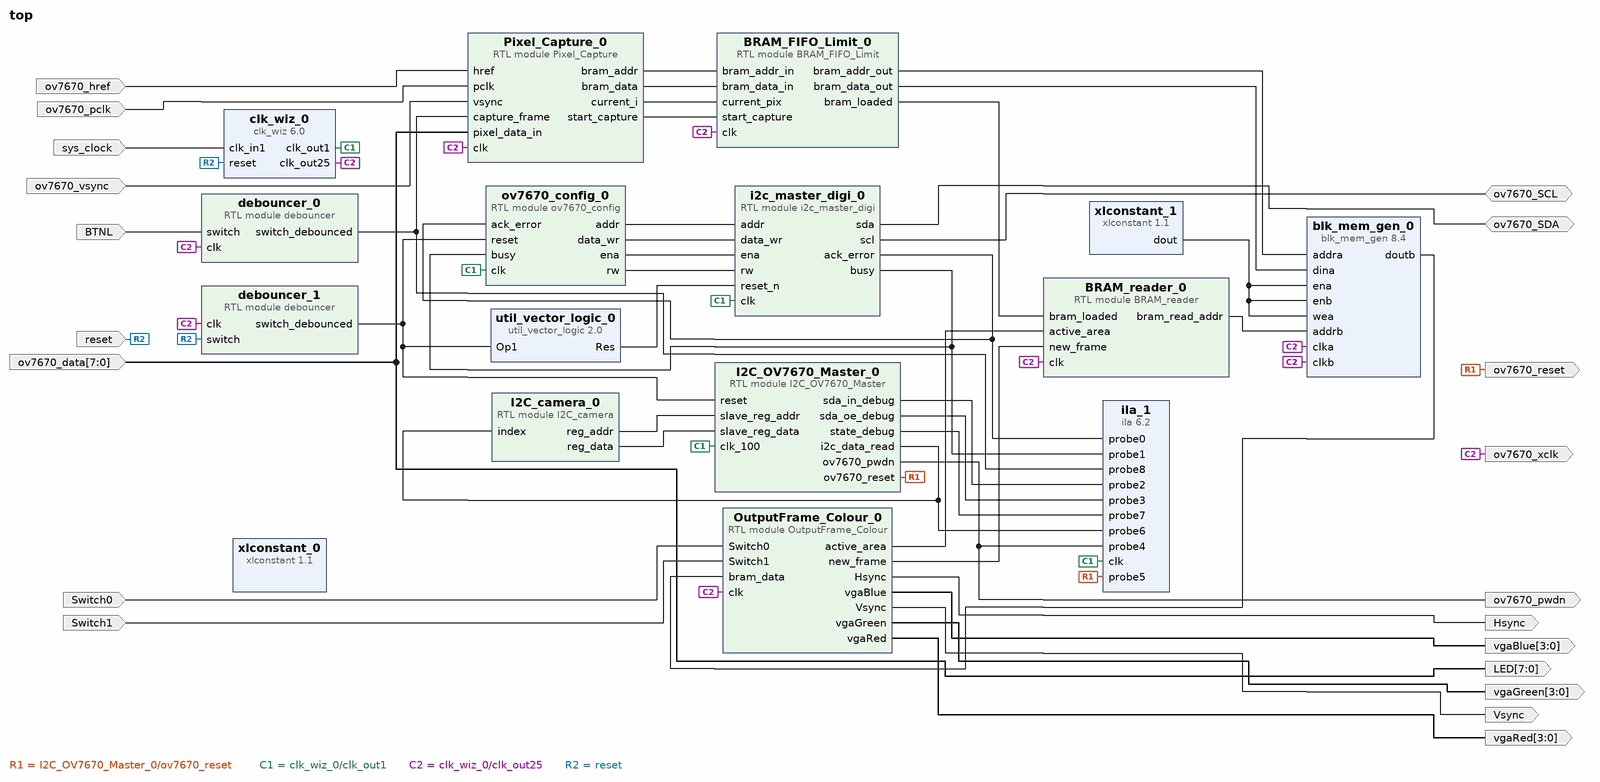
[diagram p0: block diagram of the top level]
# Vivado block design top, xc7a35tcpg236-1, Vivado 2023.2
create_bd_design top

create_bd_port -dir I -type clk sys_clock
set_property -dict {CONFIG.FREQ_HZ 100000000 CONFIG.PHASE 0.0} [get_bd_ports sys_clock]
create_bd_port -dir I -type rst reset
set_property -dict {CONFIG.POLARITY ACTIVE_HIGH} [get_bd_ports reset]
create_bd_port -dir I -from 7 -to 0 ov7670_data
create_bd_port -dir I ov7670_pclk
create_bd_port -dir I ov7670_href
create_bd_port -dir I ov7670_vsync
create_bd_port -dir I BTNL
create_bd_port -dir O Hsync
create_bd_port -dir O Vsync
create_bd_port -dir O -from 7 -to 0 LED
create_bd_port -dir O -from 3 -to 0 vgaRed
create_bd_port -dir O -from 3 -to 0 vgaGreen
create_bd_port -dir O -from 3 -to 0 vgaBlue
create_bd_port -dir I Switch0
create_bd_port -dir I Switch1
create_bd_port -dir O -type clk ov7670_xclk
create_bd_port -dir IO ov7670_SDA
create_bd_port -dir O ov7670_pwdn
create_bd_port -dir O -type rst ov7670_reset
create_bd_port -dir IO ov7670_SCL

create_bd_cell -type ip -vlnv xilinx.com:ip:clk_wiz:6.0 clk_wiz_0
set_property -dict [list \
  CONFIG.CLKOUT1_DRIVES BUFG \
  CONFIG.CLKOUT1_JITTER 137.681 \
  CONFIG.CLKOUT1_PHASE_ERROR 105.461 \
  CONFIG.CLKOUT2_DRIVES BUFG \
  CONFIG.CLKOUT2_JITTER 183.467 \
  CONFIG.CLKOUT2_PHASE_ERROR 105.461 \
  CONFIG.CLKOUT2_REQUESTED_OUT_FREQ 25 \
  CONFIG.CLKOUT2_USED true \
  CONFIG.CLKOUT3_DRIVES BUFG \
  CONFIG.CLKOUT4_DRIVES BUFG \
  CONFIG.CLKOUT5_DRIVES BUFG \
  CONFIG.CLKOUT6_DRIVES BUFG \
  CONFIG.CLKOUT7_DRIVES BUFG \
  CONFIG.CLK_IN1_BOARD_INTERFACE sys_clock \
  CONFIG.CLK_OUT2_PORT clk_out25 \
  CONFIG.MMCM_BANDWIDTH OPTIMIZED \
  CONFIG.MMCM_CLKFBOUT_MULT_F 9 \
  CONFIG.MMCM_CLKOUT0_DIVIDE_F 9 \
  CONFIG.MMCM_CLKOUT1_DIVIDE 36 \
  CONFIG.MMCM_COMPENSATION ZHOLD \
  CONFIG.NUM_OUT_CLKS 2 \
  CONFIG.PRIMITIVE PLL \
  CONFIG.RESET_BOARD_INTERFACE reset \
  CONFIG.USE_BOARD_FLOW true \
] [get_bd_cells clk_wiz_0]
create_bd_cell -type ip -vlnv xilinx.com:ip:xlconstant:1.1 xlconstant_0
create_bd_cell -type module -reference Pixel_Capture Pixel_Capture_0
create_bd_cell -type module -reference debouncer debouncer_0
create_bd_cell -type module -reference BRAM_FIFO_Limit BRAM_FIFO_Limit_0
create_bd_cell -type module -reference BRAM_reader BRAM_reader_0
create_bd_cell -type ip -vlnv xilinx.com:ip:blk_mem_gen:8.4 blk_mem_gen_0
set_property -dict [list \
  CONFIG.Assume_Synchronous_Clk true \
  CONFIG.Memory_Type True_Dual_Port_RAM \
  CONFIG.Write_Depth_A 76800 \
  CONFIG.Write_Width_A 16 \
  CONFIG.use_bram_block Stand_Alone \
] [get_bd_cells blk_mem_gen_0]
create_bd_cell -type ip -vlnv xilinx.com:ip:xlconstant:1.1 xlconstant_1
create_bd_cell -type module -reference OutputFrame_Colour OutputFrame_Colour_0
create_bd_cell -type module -reference I2C_camera I2C_camera_0
create_bd_cell -type ip -vlnv xilinx.com:ip:ila:6.2 ila_1
set_property -dict [list \
  CONFIG.C_DATA_DEPTH 16384 \
  CONFIG.C_MONITOR_TYPE Native \
  CONFIG.C_NUM_OF_PROBES 9 \
  CONFIG.C_PROBE6_WIDTH 2 \
  CONFIG.C_PROBE7_WIDTH 3 \
  CONFIG.C_PROBE8_WIDTH 1 \
  CONFIG.C_PROBE9_WIDTH 1 \
] [get_bd_cells ila_1]
create_bd_cell -type module -reference I2C_OV7670_Master I2C_OV7670_Master_0
create_bd_cell -type module -reference debouncer debouncer_1
create_bd_cell -type module -reference i2c_master_digi i2c_master_digi_0
create_bd_cell -type module -reference ov7670_config ov7670_config_0
create_bd_cell -type ip -vlnv xilinx.com:ip:util_vector_logic:2.0 util_vector_logic_0
set_property -dict {CONFIG.C_OPERATION not CONFIG.C_SIZE 1} [get_bd_cells util_vector_logic_0]

# ---- connections ----

connect_bd_net [get_bd_pins BRAM_FIFO_Limit_0/bram_addr_out] [get_bd_pins blk_mem_gen_0/addra]
connect_bd_net [get_bd_pins BRAM_FIFO_Limit_0/bram_data_out] [get_bd_pins blk_mem_gen_0/dina]
connect_bd_net [get_bd_pins BRAM_FIFO_Limit_0/bram_loaded] [get_bd_pins BRAM_reader_0/bram_loaded]
connect_bd_net [get_bd_pins BRAM_reader_0/bram_read_addr] [get_bd_pins blk_mem_gen_0/addrb]
connect_bd_net [get_bd_ports BTNL] [get_bd_pins debouncer_0/switch]
connect_bd_net [get_bd_pins I2C_OV7670_Master_0/i2c_data_read] [get_bd_pins I2C_camera_0/index] [get_bd_pins ila_1/probe6]
connect_bd_net [get_bd_pins I2C_OV7670_Master_0/ov7670_pwdn] [get_bd_ports ov7670_pwdn] [get_bd_pins ila_1/probe4]
connect_bd_net [get_bd_pins I2C_OV7670_Master_0/ov7670_reset] [get_bd_ports ov7670_reset] [get_bd_pins ila_1/probe5]
connect_bd_net [get_bd_pins I2C_OV7670_Master_0/sda_in_debug] [get_bd_pins ila_1/probe2]
connect_bd_net [get_bd_pins I2C_OV7670_Master_0/sda_oe_debug] [get_bd_pins ila_1/probe3]
connect_bd_net [get_bd_pins I2C_OV7670_Master_0/state_debug] [get_bd_pins ila_1/probe7]
connect_bd_net [get_bd_pins I2C_camera_0/reg_addr] [get_bd_pins I2C_OV7670_Master_0/slave_reg_addr]
connect_bd_net [get_bd_pins I2C_camera_0/reg_data] [get_bd_pins I2C_OV7670_Master_0/slave_reg_data]
connect_bd_net [get_bd_ports ov7670_SDA] [get_bd_pins i2c_master_digi_0/sda]
connect_bd_net [get_bd_ports ov7670_SCL] [get_bd_pins i2c_master_digi_0/scl]
connect_bd_net [get_bd_pins OutputFrame_Colour_0/Hsync] [get_bd_ports Hsync]
connect_bd_net [get_bd_pins OutputFrame_Colour_0/Vsync] [get_bd_ports Vsync]
connect_bd_net [get_bd_pins OutputFrame_Colour_0/active_area] [get_bd_pins BRAM_reader_0/active_area]
connect_bd_net [get_bd_pins OutputFrame_Colour_0/new_frame] [get_bd_pins BRAM_reader_0/new_frame]
connect_bd_net [get_bd_pins OutputFrame_Colour_0/vgaBlue] [get_bd_ports vgaBlue]
connect_bd_net [get_bd_pins OutputFrame_Colour_0/vgaGreen] [get_bd_ports vgaGreen]
connect_bd_net [get_bd_pins OutputFrame_Colour_0/vgaRed] [get_bd_ports vgaRed]
connect_bd_net [get_bd_pins Pixel_Capture_0/bram_addr] [get_bd_pins BRAM_FIFO_Limit_0/bram_addr_in]
connect_bd_net [get_bd_pins Pixel_Capture_0/bram_data] [get_bd_pins BRAM_FIFO_Limit_0/bram_data_in]
connect_bd_net [get_bd_pins Pixel_Capture_0/current_i] [get_bd_pins BRAM_FIFO_Limit_0/current_pix]
connect_bd_net [get_bd_pins Pixel_Capture_0/start_capture] [get_bd_pins BRAM_FIFO_Limit_0/start_capture]
connect_bd_net -net Switch0_1 [get_bd_ports Switch0] [get_bd_pins OutputFrame_Colour_0/Switch0]
connect_bd_net -net Switch1_1 [get_bd_ports Switch1] [get_bd_pins OutputFrame_Colour_0/Switch1]
connect_bd_net [get_bd_pins blk_mem_gen_0/doutb] [get_bd_pins OutputFrame_Colour_0/bram_data]
connect_bd_net [get_bd_pins clk_wiz_0/clk_out1] \
  [get_bd_pins ila_1/clk] [get_bd_pins I2C_OV7670_Master_0/clk_100] [get_bd_pins i2c_master_digi_0/clk] \
  [get_bd_pins ov7670_config_0/clk]
connect_bd_net [get_bd_pins clk_wiz_0/clk_out25] \
  [get_bd_pins debouncer_0/clk] [get_bd_pins blk_mem_gen_0/clka] [get_bd_pins blk_mem_gen_0/clkb] \
  [get_bd_pins BRAM_reader_0/clk] [get_bd_pins OutputFrame_Colour_0/clk] [get_bd_ports ov7670_xclk] \
  [get_bd_pins BRAM_FIFO_Limit_0/clk] [get_bd_pins Pixel_Capture_0/clk] [get_bd_pins debouncer_1/clk]
connect_bd_net [get_bd_pins debouncer_0/switch_debounced] [get_bd_pins Pixel_Capture_0/capture_frame] [get_bd_pins ila_1/probe8]
connect_bd_net [get_bd_pins debouncer_1/switch_debounced] \
  [get_bd_pins I2C_OV7670_Master_0/reset] [get_bd_pins ov7670_config_0/reset] [get_bd_pins util_vector_logic_0/Op1]
connect_bd_net [get_bd_pins i2c_master_digi_0/ack_error] [get_bd_pins ov7670_config_0/ack_error] [get_bd_pins ila_1/probe0]
connect_bd_net [get_bd_pins i2c_master_digi_0/busy] [get_bd_pins ov7670_config_0/busy] [get_bd_pins ila_1/probe1]
connect_bd_net [get_bd_pins ov7670_config_0/addr] [get_bd_pins i2c_master_digi_0/addr]
connect_bd_net [get_bd_pins ov7670_config_0/data_wr] [get_bd_pins i2c_master_digi_0/data_wr]
connect_bd_net [get_bd_pins ov7670_config_0/ena] [get_bd_pins i2c_master_digi_0/ena]
connect_bd_net [get_bd_pins ov7670_config_0/rw] [get_bd_pins i2c_master_digi_0/rw]
connect_bd_net [get_bd_ports ov7670_data] [get_bd_ports LED] [get_bd_pins Pixel_Capture_0/pixel_data_in]
connect_bd_net [get_bd_ports ov7670_href] [get_bd_pins Pixel_Capture_0/href]
connect_bd_net [get_bd_ports ov7670_pclk] [get_bd_pins Pixel_Capture_0/pclk]
connect_bd_net [get_bd_ports ov7670_vsync] [get_bd_pins Pixel_Capture_0/vsync]
connect_bd_net [get_bd_ports reset] [get_bd_pins clk_wiz_0/reset] [get_bd_pins debouncer_1/switch]
connect_bd_net [get_bd_ports sys_clock] [get_bd_pins clk_wiz_0/clk_in1]
connect_bd_net [get_bd_pins util_vector_logic_0/Res] [get_bd_pins i2c_master_digi_0/reset_n]
connect_bd_net [get_bd_pins xlconstant_1/dout] [get_bd_pins blk_mem_gen_0/wea] [get_bd_pins blk_mem_gen_0/ena] [get_bd_pins blk_mem_gen_0/enb]

validate_bd_design
save_bd_design
